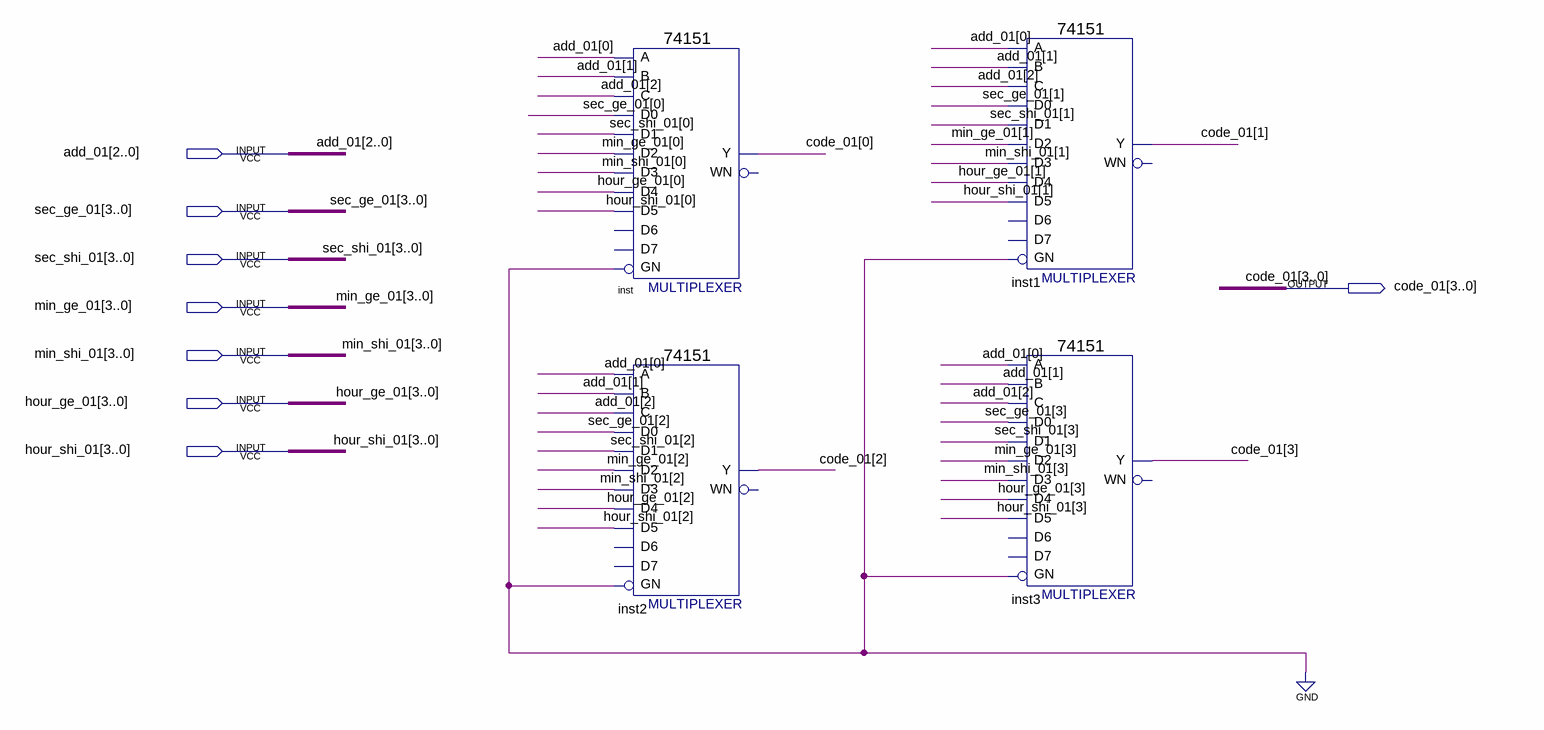
[diagram p0: schematic sheet]
// Quartus schematic seg_select.bdf as structural Verilog: 4 symbols, 8 pins
module seg_select (
  input  [2:0] add_01,
  input  [3:0] sec_ge_01,
  input  [3:0] sec_shi_01,
  input  [3:0] min_ge_01,
  input  [3:0] min_shi_01,
  input  [3:0] hour_ge_01,
  input  [3:0] hour_shi_01,
  output [3:0] code_01
);

  \74151  inst (
    .GN(1'b0), .C(add_01[2]), .B(add_01[1]), .A(add_01[0]), .D5(hour_shi_01[0]), .D0(sec_ge_01[0]),
    .D1(sec_shi_01[0]), .D4(hour_ge_01[0]), .D3(min_shi_01[0]), .D2(min_ge_01[0]), .Y(code_01[0]));  // open: D6, D7, WN
  \74151  inst2 (
    .GN(1'b0), .C(add_01[2]), .B(add_01[1]), .A(add_01[0]), .D5(hour_shi_01[2]), .D0(sec_ge_01[2]),
    .D1(sec_shi_01[2]), .D4(hour_ge_01[2]), .D3(min_shi_01[2]), .D2(min_ge_01[2]), .Y(code_01[2]));  // open: D6, D7, WN
  \74151  inst1 (
    .GN(1'b0), .C(add_01[2]), .B(add_01[1]), .A(add_01[0]), .D5(hour_shi_01[1]), .D0(sec_ge_01[1]),
    .D1(sec_shi_01[1]), .D4(hour_ge_01[1]), .D3(min_shi_01[1]), .D2(min_ge_01[1]), .Y(code_01[1]));  // open: D6, D7, WN
  \74151  inst3 (
    .GN(1'b0), .C(add_01[2]), .B(add_01[1]), .A(add_01[0]), .D5(hour_shi_01[3]), .D0(sec_ge_01[3]),
    .D1(sec_shi_01[3]), .D4(hour_ge_01[3]), .D3(min_shi_01[3]), .D2(min_ge_01[3]), .Y(code_01[3]));  // open: D6, D7, WN
endmodule
